# EAGLE design Firefly2 (EAGLE 6.4)
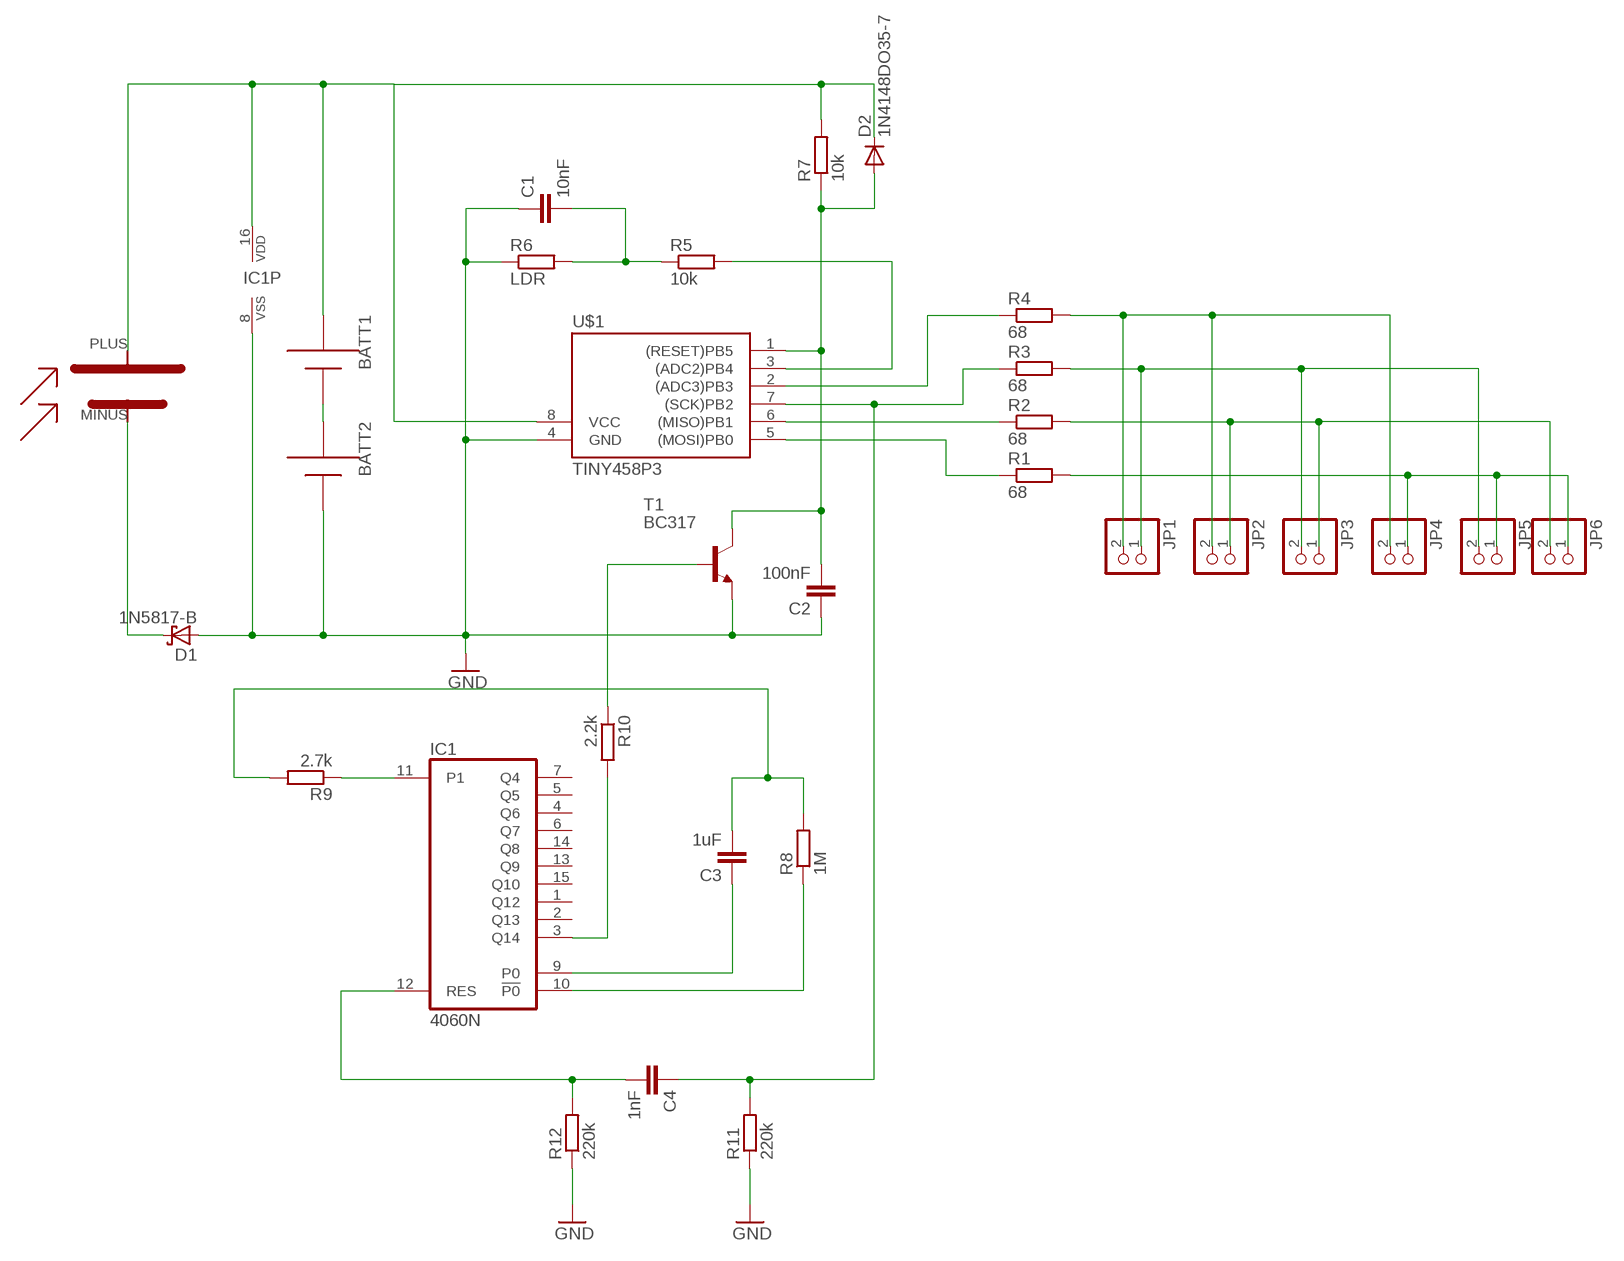
[diagram p0: schematic, sheet 1]

## Parts
BATT1  AAA  [12BH412]
BATT2  AAA  [12BH412]
C1  10nF  C-EU025-025X050  [C025-025X050]
C2  100nF  C-EU075-032X103  [C075-032X103]
C3  1uF  C-EU050-024X044  [C050-024X044]
C4  1nF  C-EU050-024X044  [C050-024X044]
D1  1N5817-B  [DO41-7.6]
D2  1N4148DO35-7  [DO35-7]
IC1  4060N  [DIL16]
JP1  PINHD-1X2  [1X02]
JP2  PINHD-1X2  [1X02]
JP3  PINHD-1X2  [1X02]
JP4  PINHD-1X2  [1X02]
JP5  PINHD-1X2  [1X02]
JP6  PINHD-1X2  [1X02]
R1  68  R-EU_0204/7  [0204/7]
R2  68  R-EU_0204/7  [0204/7]
R3  68  R-EU_0207/12  [0207/12]
R4  68  R-EU_0204/7  [0204/7]
R5  10k  R-EU_0207/10  [0207/10]
R6  LDR  R-EU_0204/7  [0204/7]
R7  10k  R-EU_0204/7  [0204/7]
R8  1M  R-EU_0204/7  [0204/7]
R9  2.7k  R-EU_0204/2V  [0204V]
R10  2.2k  R-EU_0204/7  [0204/7]
R11  220k  R-EU_0204/7  [0204/7]
R12  220k  R-EU_0204/7  [0204/7]
T1  BC317  BC317-NPN-TO92-EBC  [TO92-EBC]
U$1  TINY458P3  [DIL08]
U$2  SOLARCELL4V35MACONRAD  [SOLARCELL35X39]

## Nets
GND: BATT2.- C1.1 C2.1 D1.A IC1.8(VSS) R6.1 R11.1 R12.1 T1.E U$1.4(GND)
N$1: R1.1 U$1.5((MOSI)PB0)
N$2: R2.1 U$1.6((MISO)PB1)
N$4: R4.1 U$1.2((ADC3)PB3)
N$5: JP1.2 JP2.2 JP4.2 R4.2
N$6: BATT1.- BATT2.+
N$7: JP2.1 JP3.1 JP6.2 R2.2
N$8: JP1.1 JP3.2 JP5.2 R3.2
N$9: C2.2 D2.A R7.1 T1.C U$1.1((RESET)PB5)
N$10: JP4.1 JP5.1 JP6.1 R1.2
N$11: BATT1.+ D2.C IC1.16(VDD) R7.2 U$1.8(VCC) U$2.PLUS
N$12: D1.C U$2.MINUS
N$13: R5.2 U$1.3((ADC2)PB4)
N$14: C1.2 R5.1 R6.2
N$17: C3.1 IC1.9(P0)
N$18: C3.2 R8.2 R9.2
N$19: IC1.10(!P0) R8.1
N$20: IC1.3(Q14) R10.2
N$21: IC1.11(P1) R9.1
N$22: R10.1 T1.B
N$24: C4.2 IC1.12(RES) R12.2
N$25: C4.1 R3.1 R11.2 U$1.7((SCK)PB2)
Unconnected: IC1.1(Q12) IC1.2(Q13) IC1.4(Q6) IC1.5(Q5) IC1.6(Q7) IC1.7(Q4) IC1.13(Q9) IC1.14(Q8) IC1.15(Q10)

## Library data of the parts
BATT1 BATT2 = adafruit:AAA: AAA PC pin holder Mouser part #12BH412 - but pretty much any 1x AAA battery holder should be the same http://www.ladyada.net/library/pcb/eaglelibrary.html
C1-C4 = resistor:C-EU: CAPACITOR, European symbol
D1 = diode:1N581*: 1.0A SCHOTTKY BARRIER RECTIFIER Source: http://www.diodes.com/datasheets/ds23001.pdf
D2 = diode:1N4148: DIODE high speed (Philips)
IC1 = 40xx:4060: 14-stage binary/ripple COUNTER
JP1-JP6 = pinhead:PINHD-1X2: PIN HEADER
R1-R12 = resistor:R-EU_: RESISTOR, European symbol
T1 = transistor:*-NPN-: NPN Transistror BF959 corrected 2008.03.06
U$1 = firefly:TINY45*
U$2 = firefly:SOLARCELL4V35MACONRAD: Conrad Miniatur-Solarzellen Monokristallin Nennspannung 4 V Nennstrom 35 mA Technische Daten Nennspannung 4 V Nennstrom 35 mA Abm. (L x B) 39 mm x 35 mm Ausführung Monokristallin

## Board
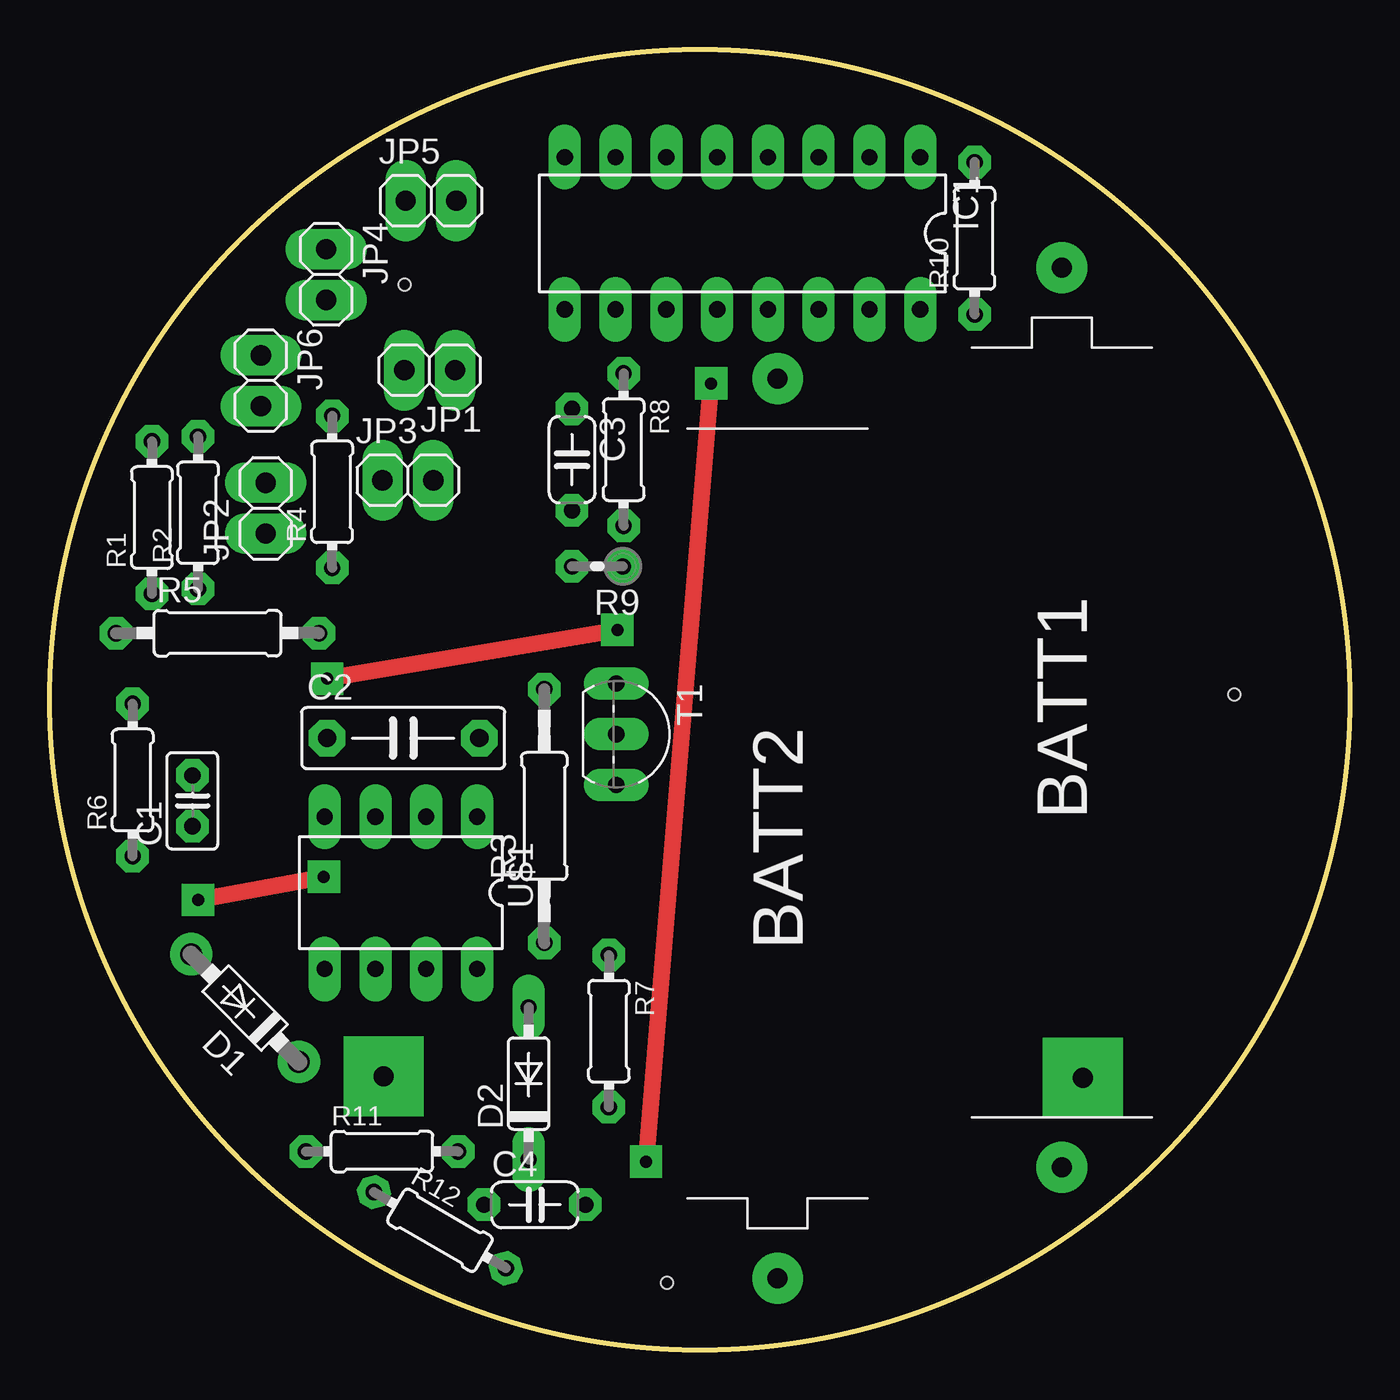
[diagram p1: board, top side]
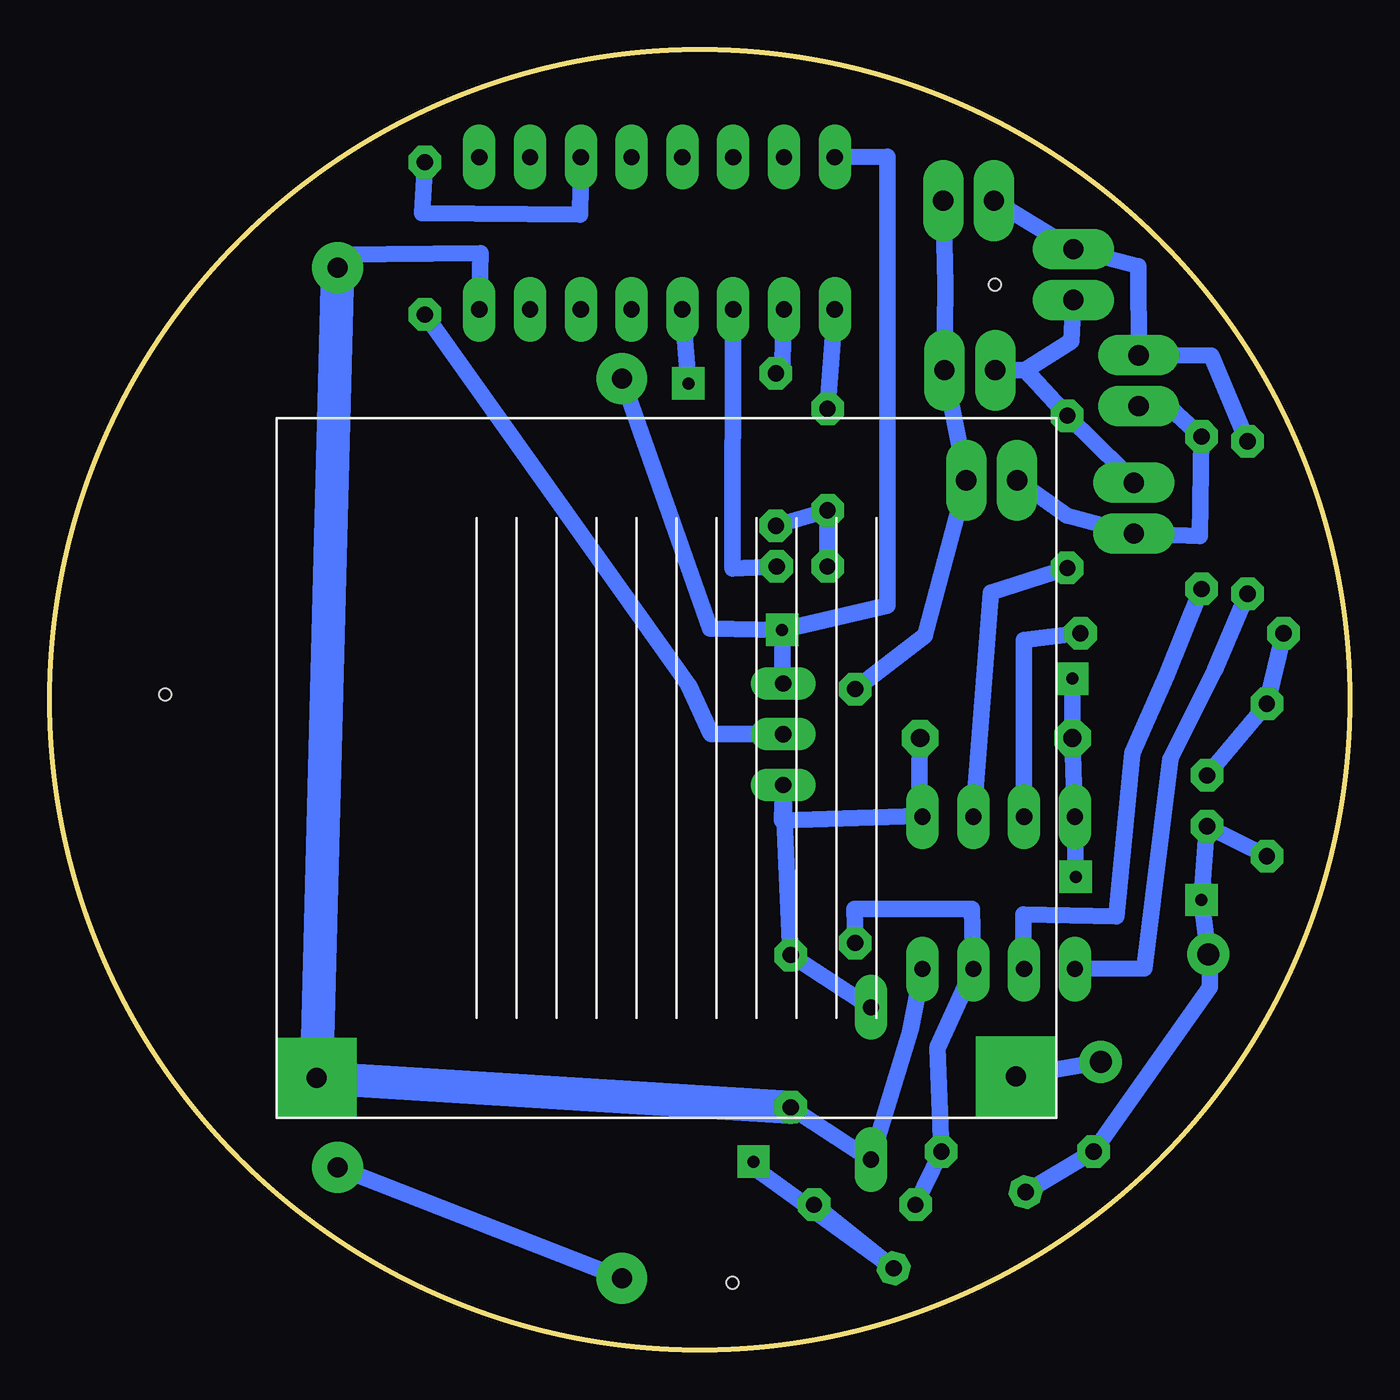
[diagram p2: board, bottom side, seen from below]

Size 65 x 65 mm. Coordinates in mm from the lower left corner, seen from the top.
Outline: circle at 32.5,32.5 radius 32.5
Copper layers (1*16): Top 0.035mm / dielectric 1.5mm / Bottom 0.035mm
Design rules "default *": minimum track width 10mil, minimum drill 24mil, track to track 8mil, track to pad 8mil, pad to pad 8mil, via to via 8mil, smd to smd 8mil, copper to edge 40mil, drill to drill 8mil, minimum pad ring 10mil, minimum via ring 8mil, stop-mask expansion 4mil, vias tented up to drill 0mil, thermal gap 10mil
Holes 0.6 mm at 59.24,32.77 30.87,3.34 17.75,53.25

### Footprints (pad centres in the part's own frame; a part is rotated, then mirrored left to right if it is on the bottom)
12BH412 = drill 1 pad 2.54: + 22.5,0; - -22.5,0
C025-025X050 = drill 0.813 octagon: 1 -1.27,0; 2 1.27,0
C075-032X103 = drill 0.914 octagon: 1 -3.81,0; 2 3.81,0
C050-024X044 = drill 0.813 octagon: 1 -2.54,0; 2 2.54,0
DO41-7.6 = drill 1.1 pad 1.7: A 3.81,0; C -3.81,0
DO35-7 = drill 0.813 long: A 3.81,0; C -3.81,0
DIL16 = drill 0.813 long: 1 -8.89,-3.81; 2 -6.35,-3.81; 3 -3.81,-3.81; 4 -1.27,-3.81; 5 1.27,-3.81; 6 3.81,-3.81; 7 6.35,-3.81; 8 8.89,-3.81; 9 8.89,3.81; 10 6.35,3.81; 11 3.81,3.81; 12 1.27,3.81; 13 -1.27,3.81; 14 -3.81,3.81; 15 -6.35,3.81; 16 -8.89,3.81
1X02 = drill 1.016 long: 1 -1.27,0; 2 1.27,0
0204/7 = drill 0.813 octagon: 1 -3.81,0; 2 3.81,0
0207/12 = drill 0.813 octagon: 1 -6.35,0; 2 6.35,0
0207/10 = drill 0.813 octagon: 1 -5.08,0; 2 5.08,0
0204V = drill 0.813 octagon: 1 -1.27,0; 2 1.27,0
TO92-EBC = drill 0.813 long: B 0,-1.27; C 2.54,-1.27; E -2.54,-1.27
DIL08 = drill 0.813 long: 1 -3.81,-3.81; 2 -1.27,-3.81; 3 1.27,-3.81; 4 3.81,-3.81; 5 3.81,3.81; 6 1.27,3.81; 7 -1.27,3.81; 8 -3.81,3.81
SOLARCELL35X39 = drill 1 pad 4 square: MINUS 36.96,2.07; PLUS 2,2

### Placement (x,y rotation side)
BATT1  50.61,31.61 90 top
BATT2  36.4,26.06 270 top
C1  7.13,27.44 90 top
C2  17.67,30.59 0 top
C3  26.11,44.51 270 top
C4  24.25,7.24 0 top
D1  9.75,17.08 135 top
D2  23.94,13.3 90 top
IC1  34.64,55.83 180 top
JP1  18.99,48.98 180 top
JP2  10.79,42.08 90 top
JP3  17.9,43.48 0 top
JP4  13.81,53.77 270 top
JP5  19.05,57.46 0 top
JP6  10.54,48.46 270 top
R1  5.1,41.61 90 top
R2  7.41,41.85 90 top
R3  24.72,26.69 90 top
R4  14.11,42.9 90 top
R5  8.38,35.83 0 top
R6  4.14,28.49 90 top
R7  27.95,15.92 270 top
R8  28.69,45.01 270 top
R9  27.38,39.17 180 top
R10  46.25,55.58 90 top
R11  16.61,9.9 0 top
R12  19.5,5.97 330 top
T1  29.6,30.78 270 top
U$1  17.55,22.85 180 top
U$2  53.66,11.58 0 bottom

### Tracks (layer width: path | path; a pad name or v marks a point on that pad's centre or on a via)
GND  (via drill 0.6)
  Top 0.813: v13.86,33.55 v28.38,36 | v13.69,23.64 v7.41,22.49
  Bottom 0.813: v13.86,33.55 C2.1 U$1.4 v13.69,23.64 | R6.1 C1.1 v7.41,22.49 D1.A 7,19.77 7,18.12 R11.1 R12.1 | v28.38,36 28.32,36.01 | T1.E v28.38,36 | v28.38,36 31.98,36.07 BATT2.- | IC1.8 23.11,59.65 23.11,37.21 v28.38,36
N$1
  Bottom 0.813: R1.1 6.74,33.99 8.96,29.54 10.26,19.06 U$1.5
N$2
  Bottom 0.813: R2.1 9.16,33.7 10.86,29.85 11.66,21.67 16.32,21.76 U$1.6
N$4
  Bottom 0.813: U$1.2 17.93,37.87 R4.1
N$5
  Bottom 0.813: JP2.2 11.33,43.99 R4.2 16.21,48.98 | 16.21,48.98 JP1.2 | JP4.2 13.91,50.43 16.21,48.98
N$6
  Bottom 0.813: BATT2.+ BATT1.-
N$7
  Bottom 0.813: JP3.1 14.13,41.72 JP2.1 7.49,40.68 R2.2 8.95,47.1 JP6.2
N$8
  Bottom 0.813: R3.2 21.24,35.72 JP3.2 JP1.1 20.2,53.23 JP5.2
N$9
  Bottom 0.813: U$1.1 21.53,26.68 | 21.53,26.68 28.4,26.46 T1.C R7.1 D2.A | 21.53,26.68 C2.2
N$10
  Bottom 0.813: R1.2 6.91,49.7 JP6.1 10.57,54.18 JP4.1 JP5.1
N$11
  Bottom 0.813: IC1.16 43.47,54.84 50.57,54.76 BATT1.+ | R7.2 D2.C 21.97,15.97 U$1.8
  Bottom 1.676: R7.2 U$2.PLUS BATT1.+
N$12
  Bottom 0.813: D1.C U$2.MINUS
N$13
  Bottom 0.813: R5.2 16.3,35.49 U$1.3
N$14
  Bottom 0.813: R5.1 R6.2 C1.2
N$17
  Bottom 0.813: C3.1 25.93,49.34 IC1.9
N$18
  Bottom 0.813: R9.2 C3.2 R8.2
N$19
  Bottom 0.813: IC1.10 28.39,48.64 R8.1
N$20
  Bottom 0.813: IC1.3 38.49,56.76 46.38,56.84 R10.2
N$21
  Bottom 0.813: R9.1 30.85,39.07 IC1.11
N$22
  Bottom 0.813: R10.1 33.05,33.23 31.95,30.79 T1.B
N$24  (via drill 0.6)
  Top 0.813: v29.82,9.4 v33.07,48.32
  Bottom 0.813: C4.2 R12.2 29.73,9.06 v29.82,9.4 | v33.07,48.32 IC1.12
N$25
  Bottom 0.813: R3.1 24.75,22.03 18.89,22.03 U$1.7 20.62,15.09 R11.2 C4.1